# Altium schematic sheet FDC.SchDoc
size A3; SheetNumber: 5; SheetTotal: 15
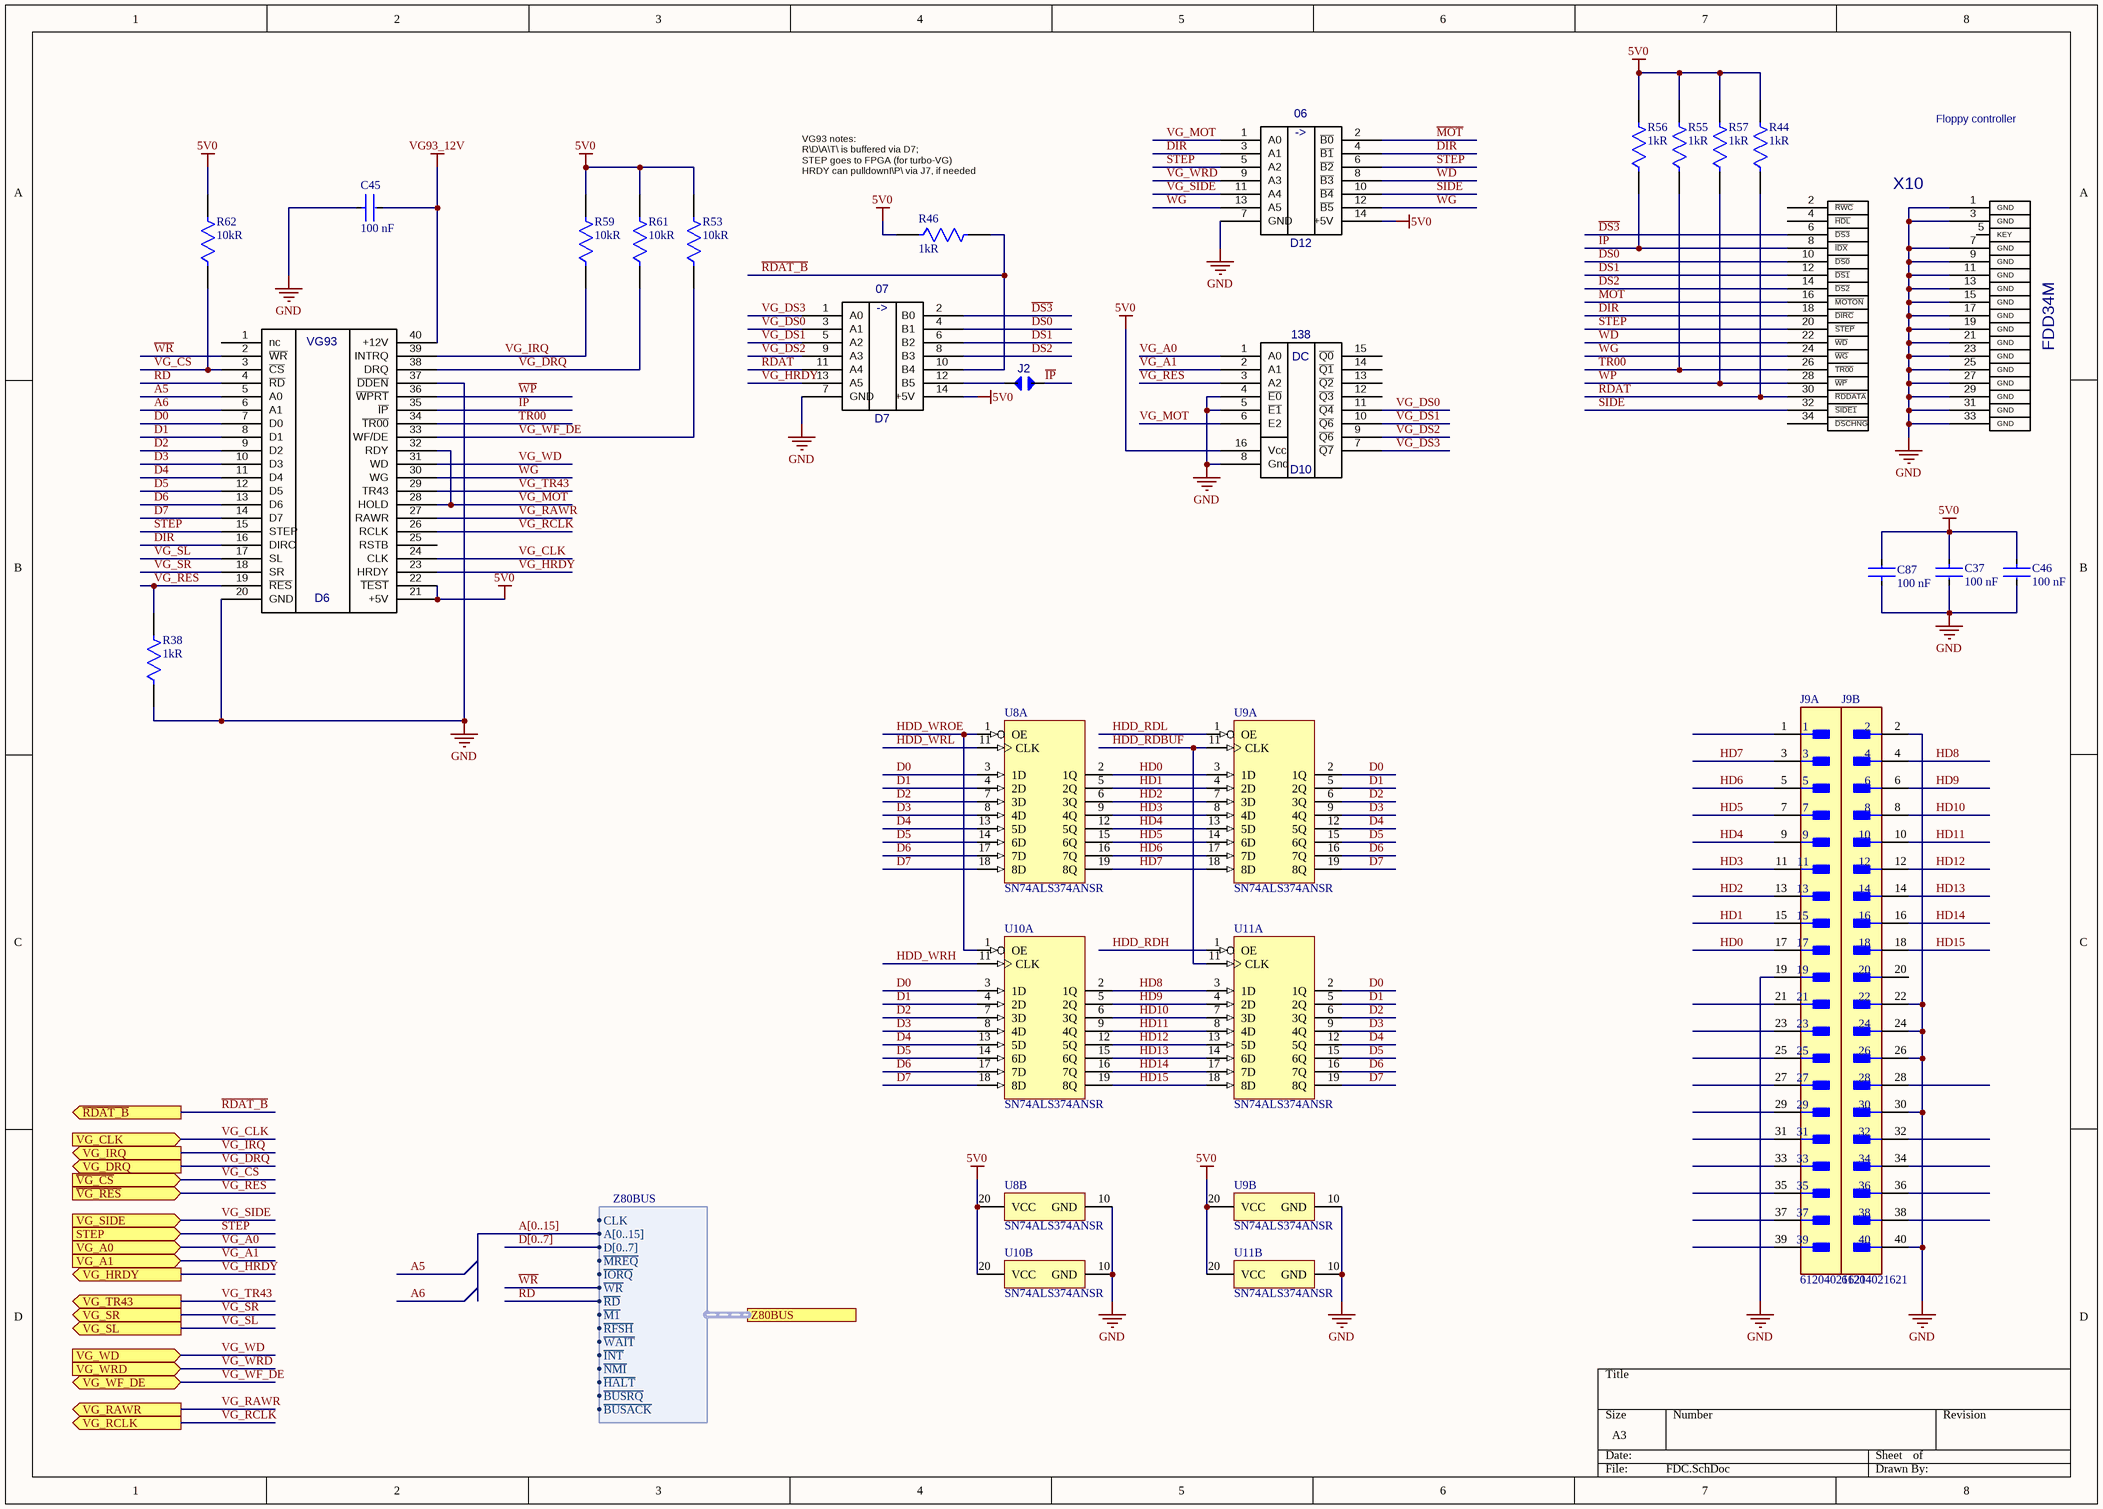
[diagram p0: FDC.SchDoc]

## Parts
C37  Capacitance: 100 nF  [FP-CC0805-0_85-IPC_A]  (hidden comment: CC0805KRX7R9BB104)
C45  Capacitance: 100 nF  [FP-CC0805-0_85-IPC_A]  (hidden comment: CC0805KRX7R9BB104)
C46  Capacitance: 100 nF  [FP-CC0805-0_85-IPC_A]  (hidden comment: CC0805KRX7R9BB104)
C87  Capacitance: 100 nF  [FP-CC0805-0_85-IPC_A]  (hidden comment: CC0805KRX7R9BB104)
D6  KR1818VG93  [DIP40]  (value not drawn)
D7  07  [SO14]
D10  138  [SO16]
D12  06  [SO14]
J2  JUMPER  [JUMPER_JUMPER(Primary)]  (value not drawn)
J9  61204021621  [FP-61204021621-MFG]  (parts A,B of 2)
R38  Resistance: 1kR  [FP-CRCW0805-HPe3-IPC_A]  (hidden comment: CRCW08051K00FKEAHP)
R44  Resistance: 1kR  [FP-CRCW0805-HPe3-IPC_A]  (hidden comment: CRCW08051K00FKEAHP)
R46  Resistance: 1kR  [FP-CRCW0805-HPe3-IPC_A]  (hidden comment: CRCW08051K00FKEAHP)
R53  Resistance: 10kR  [FP-CR0805-IPC_A]  (hidden comment: CR0805-JW-103ELF)
R55  Resistance: 1kR  [FP-CRCW0805-HPe3-IPC_A]  (hidden comment: CRCW08051K00FKEAHP)
R56  Resistance: 1kR  [FP-CRCW0805-HPe3-IPC_A]  (hidden comment: CRCW08051K00FKEAHP)
R57  Resistance: 1kR  [FP-CRCW0805-HPe3-IPC_A]  (hidden comment: CRCW08051K00FKEAHP)
R59  Resistance: 10kR  [FP-CR0805-IPC_A]  (hidden comment: CR0805-JW-103ELF)
R61  Resistance: 10kR  [FP-CR0805-IPC_A]  (hidden comment: CR0805-JW-103ELF)
R62  Resistance: 10kR  [FP-CR0805-IPC_A]  (hidden comment: CR0805-JW-103ELF)
U8  SN74ALS374ANSR  [NS0020A_M]  (parts A,B of 2)
U9  SN74ALS374ANSR  [NS0020A_M]  (parts A,B of 2)
U10  SN74ALS374ANSR  [NS0020A_M]  (parts A,B of 2)
U11  SN74ALS374ANSR  [NS0020A_M]  (parts A,B of 2)
X10  FDD34M  [FDD34M]

## Ports
STEP (in), VG_A0 (in), VG_A1 (in), VG_CLK (in), VG_DRQ (out), VG_HRDY (out), VG_IRQ (out), VG_RAWR (out), VG_RCLK (out), VG_SIDE (in), VG_SL (out), VG_SR (out), VG_TR43 (out), VG_WD (in), VG_WF_DE (bidir), VG_WRD (in), Z80BUS (harness Z80BUS), ~{RDAT_B} (out), ~{VG_CS} (in), ~{VG_RES} (in)

## Harnesses
Z80BUS: A[0..15], D[0..7], ~{MREQ}, ~{IORQ}, ~{WR}, ~{RD}, ~{M1}, ~{RFSH}, ~{WAIT}, ~{INT}, ~{NMI}, ~{HALT}, ~{BUSRQ}, ~{BUSACK}, CLK

## Nets
5V0: C37.1 C46.1 C87.2 D6.21(+5V) D6.22(~{TEST}) D7.14(+5V) D10.16(Vcc) D12.14(+5V) R44.2 R46.1 R53.2 R55.2 R56.2 R57.2 R59.2 R61.2 R62.2 U8.20(VCC) U9.20(VCC) U10.20(VCC) U11.20(VCC)
GND: C37.2 C45.1 C46.2 C87.1 D6.20(GND) D6.37(~{DDEN}) D7.7(GND) D10.4(~{E0}) D10.5(~{E1}) D10.8(Gnd) D12.7(GND) J9.2 J9.19 J9.22 J9.24 J9.26 J9.30 J9.40 R38.1 U8.10(GND) U9.10(GND) U10.10(GND) U11.10(GND) X10.1(GND) X10.3(GND) X10.7(GND) X10.9(GND) X10.11(GND) X10.13(GND) X10.15(GND) X10.17(GND) X10.19(GND) X10.21(GND) X10.23(GND) X10.25(GND) X10.27(GND) X10.29(GND) X10.31(GND) X10.33(GND)
VG93_12V: C45.2 D6.40(+12V)
A5: D6.5(A0)
A6: D6.6(A1)
D0: D6.7(D0) U8.3(1D) U9.2(1Q) U10.3(1D) U11.2(1Q)
D1: D6.8(D1) U8.4(2D) U9.5(2Q) U10.4(2D) U11.5(2Q)
D2: D6.9(D2) U8.7(3D) U9.6(3Q) U10.7(3D) U11.6(3Q)
D3: D6.10(D3) U8.8(4D) U9.9(4Q) U10.8(4D) U11.9(4Q)
D4: D6.11(D4) U8.13(5D) U9.12(5Q) U10.13(5D) U11.12(5Q)
D5: D6.12(D5) U8.14(6D) U9.15(6Q) U10.14(6D) U11.15(6Q)
D6: D6.13(D6) U8.17(7D) U9.16(7Q) U10.17(7D) U11.16(7Q)
D7: D6.14(D7) U8.18(8D) U9.19(8Q) U10.18(8D) U11.19(8Q)
~{DIR}: D12.4(~{B1}) X10.18(~{DIRC})
~{DS0}: D7.4(B1) X10.10(~{DS0})
~{DS1}: D7.6(B2) X10.12(~{DS1})
~{DS2}: D7.8(B3) X10.14(~{DS2})
~{DS3}: D7.2(B0) X10.6(~{DS3})
DIR: D6.16(DIRC) D12.3(A1)
HD0: J9.17 U8.2(1Q) U9.3(1D)
HD1: J9.15 U8.5(2Q) U9.4(2D)
HD2: J9.13 U8.6(3Q) U9.7(3D)
HD3: J9.11 U8.9(4Q) U9.8(4D)
HD4: J9.9 U8.12(5Q) U9.13(5D)
HD5: J9.7 U8.15(6Q) U9.14(6D)
HD6: J9.5 U8.16(7Q) U9.17(7D)
HD7: J9.3 U8.19(8Q) U9.18(8D)
HD8: J9.4 U10.2(1Q) U11.3(1D)
HD9: J9.6 U10.5(2Q) U11.4(2D)
HD10: J9.8 U10.6(3Q) U11.7(3D)
HD11: J9.10 U10.9(4Q) U11.8(4D)
HD12: J9.12 U10.12(5Q) U11.13(5D)
HD13: J9.14 U10.15(6Q) U11.14(6D)
HD14: J9.16 U10.16(7Q) U11.17(7D)
HD15: J9.18 U10.19(8Q) U11.18(8D)
HDD_RDBUF: U9.11(CLK) U11.11(CLK)
HDD_RDH: U11.1(OE)
HDD_RDL: U9.1(OE)
HDD_WRH: U10.11(CLK)
HDD_WRL: U8.11(CLK)
HDD_WROE: U8.1(OE) U10.1(OE)
~{IP}: D6.35(~{IP}) J2.1 R56.1 X10.8(~{IDX})
~{MOT}: D12.2(~{B0}) X10.16(~{MOTON})
~{RD}: D6.4(~{RD}) ; port Z80BUS.~{RD}
~{RDAT}: D7.11(A4) R44.1 X10.30(~{RDDATA})
~{RDAT_B}: D7.10(B4) R46.2 ; port ~{RDAT_B}
~{SIDE}: D12.10(~{B4}) X10.32(~{SIDE1})
~{STEP}: D12.6(~{B2}) X10.20(~{STEP})
STEP: D6.15(STEP) D12.5(A2) ; port STEP
~{TR00}: D6.34(~{TR00}) R55.1 X10.26(~{TR00})
~{VG_CS}: D6.3(~{CS}) R62.1 ; port ~{VG_CS}
~{VG_RES}: D6.19(~{RES}) D10.3(A2) R38.2 ; port ~{VG_RES}
VG_A0: D10.1(A0) ; port VG_A0
VG_A1: D10.2(A1) ; port VG_A1
VG_CLK: D6.24(CLK) ; port VG_CLK
VG_DRQ: D6.38(DRQ) R61.1 ; port VG_DRQ
VG_DS0: D7.3(A1) D10.11(~{Q4})
VG_DS1: D7.5(A2) D10.10(~{Q6})
VG_DS2: D7.9(A3) D10.9(~{Q6})
VG_DS3: D7.1(A0) D10.7(~{Q7})
VG_HRDY: D6.23(HRDY) D7.13(A5) ; port VG_HRDY
VG_IRQ: D6.39(INTRQ) R59.1 ; port VG_IRQ
VG_MOT: D6.28(HOLD) D6.32(RDY) D10.6(E2) D12.1(A0)
VG_RAWR: D6.27(RAWR) ; port VG_RAWR
VG_RCLK: D6.26(RCLK) ; port VG_RCLK
VG_SIDE: D12.11(A4) ; port VG_SIDE
VG_SL: D6.17(SL) ; port VG_SL
VG_SR: D6.18(SR) ; port VG_SR
VG_TR43: D6.29(TR43) ; port VG_TR43
VG_WD: D6.31(WD) ; port VG_WD
VG_WF_DE: D6.33(WF/DE) R53.1 ; port VG_WF_DE
VG_WRD: D12.9(A3) ; port VG_WRD
~{WD}: D12.8(~{B3}) X10.22(~{WD})
~{WG}: D12.12(~{B5}) X10.24(~{WG})
~{WP}: D6.36(~{WPRT}) R57.1 X10.28(~{WP})
~{WR}: D6.2(~{WR}) ; port Z80BUS.~{WR}
WG: D6.30(WG) D12.13(A5)
NetD7_12: D7.12(B5) J2.0

Not connected (* = marked no-connect by the designer): D6 1(nc) 25(RSTB); D10 12(~{Q3}) 13(~{Q2}) 14(~{Q1}) 15(~{Q0}); J9 1 20 21 23 25 27 28 29 31 32 33 34 35 36 37 38 39; X10 2(~{RWC}) 4(~{HDL}) 5(KEY) 34(~{DSCHNG})

## Buses and harness runs
bus A[0..15]
bus D[0..7]

## Notes on the sheet
- Floppy controller
- (near R46) VG93 notes:
  R\D\A\T\ is buffered via D7;
  STEP goes to FPGA (for turbo-VG)
  HRDY can pulldownI\P\ via J7, if needed
- (in symbol 06) ->
- (in symbol 07) ->
- (in symbol 138) DC
- (in symbol KR1818VG93) VG93

## Library data of the parts
C37 C45 C46 C87 = CMP-2100-03606-3: CAP CER 0.1UF 50V X7R 0805; Manufacturer: Yageo; Value: 100 nF; Manufacturer Part Number: CC0805KRX7R9BB104; Category: Cap; Case/Package: 0805
D7 = 07: Value: 74HCT07; Case/Package: SOIC-14; Category: IC
D10 = 138: value: 74HCT138; Case/Package: SOIC-16; Category: IC
D12 = 06: Value: 74HCT06; Case/Package: SOIC-14; Category: IC
J2 = JUMPER: HLT->~IP; Value: PLS-2; Case/Package: PLS-2; Category: Connector
J9 = CMP-1502-00015-2: CONN HEADER VERT 40POS 2.54MM; Gender: Male; Pitch: 0.1inch; Number of Contacts: 40; Voltage Rating: 250V; Packaging: Tray; Contact Shape: Square; Termination: Solder; Contact Finish - Mating: GOLD; Number of Rows: 2; Mount: Through Hole; Fastening Type: Pull; Contact Type: Male Pin; Min Operating Temperature: -40°C; Contact Material: Copper Alloy; RoHS Compliant: Yes; Max Operating Temperature: 125°C; Color: Black; Insulation Color: Black; Flammability Rating: UL94 V-0; Insulation Material: PBT; Number of Positions: 40; Connector Type: Header; Contact Plating: Gold; Series: WR-BHD; Row Spacing: 0.1inch
R38 R44 R46 R55-R57 = CMP-02407-004529-1: RES Thick Film, 1kΩ, 1%, 0.5W, 100ppm/°C, 0805; Manufacturer: Vishay Dale; Case/Package: 0805; Number of Pins: 2; Termination: Solder; Manufacturer Part Number: CRCW08051K00FKEAHP; value: 1kΩ; Category: Res
R53 R59 R61 R62 = CMP-07231-003873-1: Thick Film Chip Resistors 0805 10kΩ 0.125W 5% 200ppm/°C; Manufacturer: Bourns; value: 10kΩ; Manufacturer Part Number: CR0805-JW-103ELF; Number of Terminations: 2; Termination: SMD/SMT; Number of Pins: 2; Case/Package: 0805; Category: Res
U8-U11 = CMP-1619-00865-2: Octal D-Type Edge Triggered Flip-Flops with 3-State Outputs, NS0020A, LARGE T&R; Manufacturer: Texas Instruments; Voltage(Nom)(V): 5; Output Drive (IOL/IOH)(Max)(mA): 24/-2.6; F @ Nom Voltage(Max)(Mhz): 75; VCC(Min)(V): 4.5; VCC(Max)(V): 5.5; Input Type: TTL; Bits(#): 8; 3-State Output: Yes; Schmitt Trigger: No; tpd @ Nom Voltage(Max)(ns): 16; ICC @ Nom Voltage(Max)(mA): 31; Technology Family: ALS; Output Logic: Non-inverted; Rating: Catalog; Generic Part Number: SN74ALS374A; Operating Temperature Range(C): 0 to 70; DatasheetVersion: SDAS167C; PackageReference: NS0020A; Output Type: TTL
X10 = FDD34M: Value: Shrouded Header 34 pos 2.54mm 2 row; Case/Package: IDC-34; Category: Connector
D6 = KR1818VG93: Value: KR1818VG93; Case/Package: DIP-40; Category: IC